# Altium schematic sheet ESP32_top.SchDoc
size A; SheetNumber: 1; SheetTotal: 9
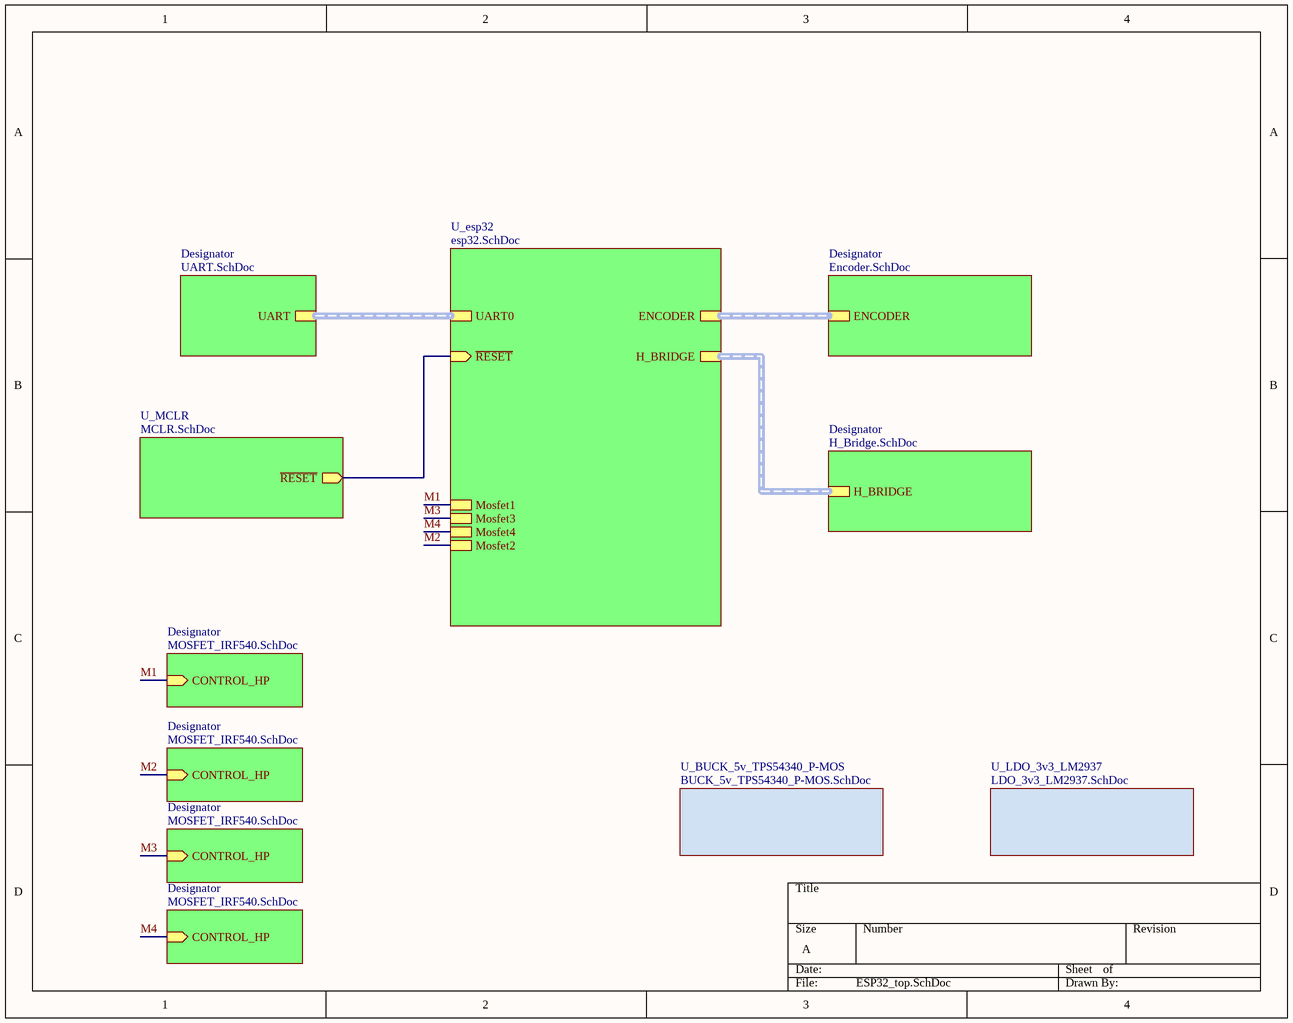
[diagram p0: ESP32_top.SchDoc]

## Sub-sheets
Designator = UART.SchDoc: UART (harness Conn.UART)
Designator = Encoder.SchDoc: ENCODER (harness conn. encoder)
Designator = H_Bridge.SchDoc: H_BRIDGE (harness conn.h_bridge)
Designator = MOSFET_IRF540.SchDoc: CONTROL_HP (in)
Designator = MOSFET_IRF540.SchDoc: CONTROL_HP (in)
Designator = MOSFET_IRF540.SchDoc: CONTROL_HP (in)
Designator = MOSFET_IRF540.SchDoc: CONTROL_HP (in)
U_BUCK_5v_TPS54340_P-MOS = BUCK_5v_TPS54340_P-MOS.SchDoc: no entries
U_esp32 = esp32.SchDoc: UART0 (harness esp.32 UART), ENCODER (harness esp32. encoder), ~{RESET} (in), H_BRIDGE (harness esp32. h_bridge), Mosfet1, Mosfet3, Mosfet4, Mosfet2
U_LDO_3v3_LM2937 = LDO_3v3_LM2937.SchDoc: no entries
U_MCLR = MCLR.SchDoc: ~{RESET} (out)

## Nets
M1: sheet U_esp32/Mosfet1, sheet Designator/CONTROL_HP
M2: sheet U_esp32/Mosfet2, sheet Designator/CONTROL_HP
M3: sheet U_esp32/Mosfet3, sheet Designator/CONTROL_HP
M4: sheet U_esp32/Mosfet4, sheet Designator/CONTROL_HP
(unnamed): sheet U_MCLR/~{RESET}, sheet U_esp32/~{RESET}

## Buses and harness runs
harness sheet Designator/ENCODER = sheet U_esp32/ENCODER
harness sheet Designator/H_BRIDGE = sheet U_esp32/H_BRIDGE
harness sheet Designator/UART = sheet U_esp32/UART0